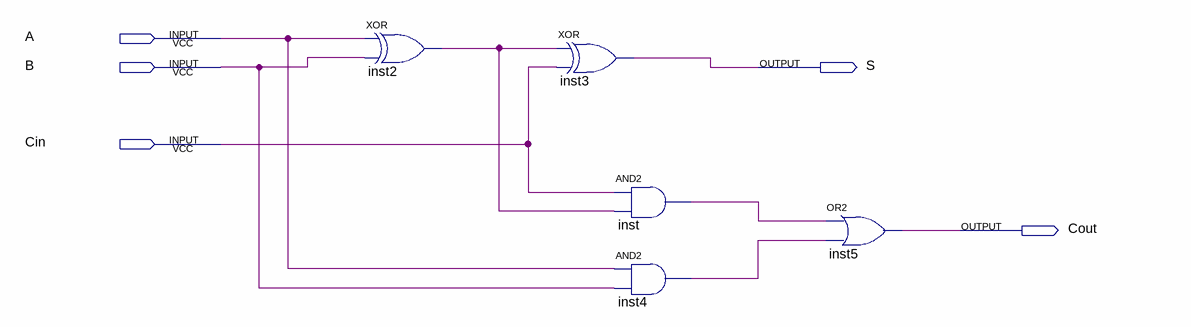
[diagram p0: schematic sheet]
// Quartus schematic LAB_1_129.bdf as structural Verilog: 5 symbols, 5 pins
module LAB_1_129 (
  input  A,
  input  B,
  input  Cin,
  output S,
  output Cout
);

  wire inst2_out, inst4_out, inst_out;

  xor inst2 (inst2_out, A, B);
  xor inst3 (S, inst2_out, Cin);
  and inst (inst_out, Cin, inst2_out);
  and inst4 (inst4_out, A, B);
  or inst5 (Cout, inst_out, inst4_out);
endmodule
